# EAGLE schematic ai_gpiolabel_rpiplus (EAGLE 7.1.0)
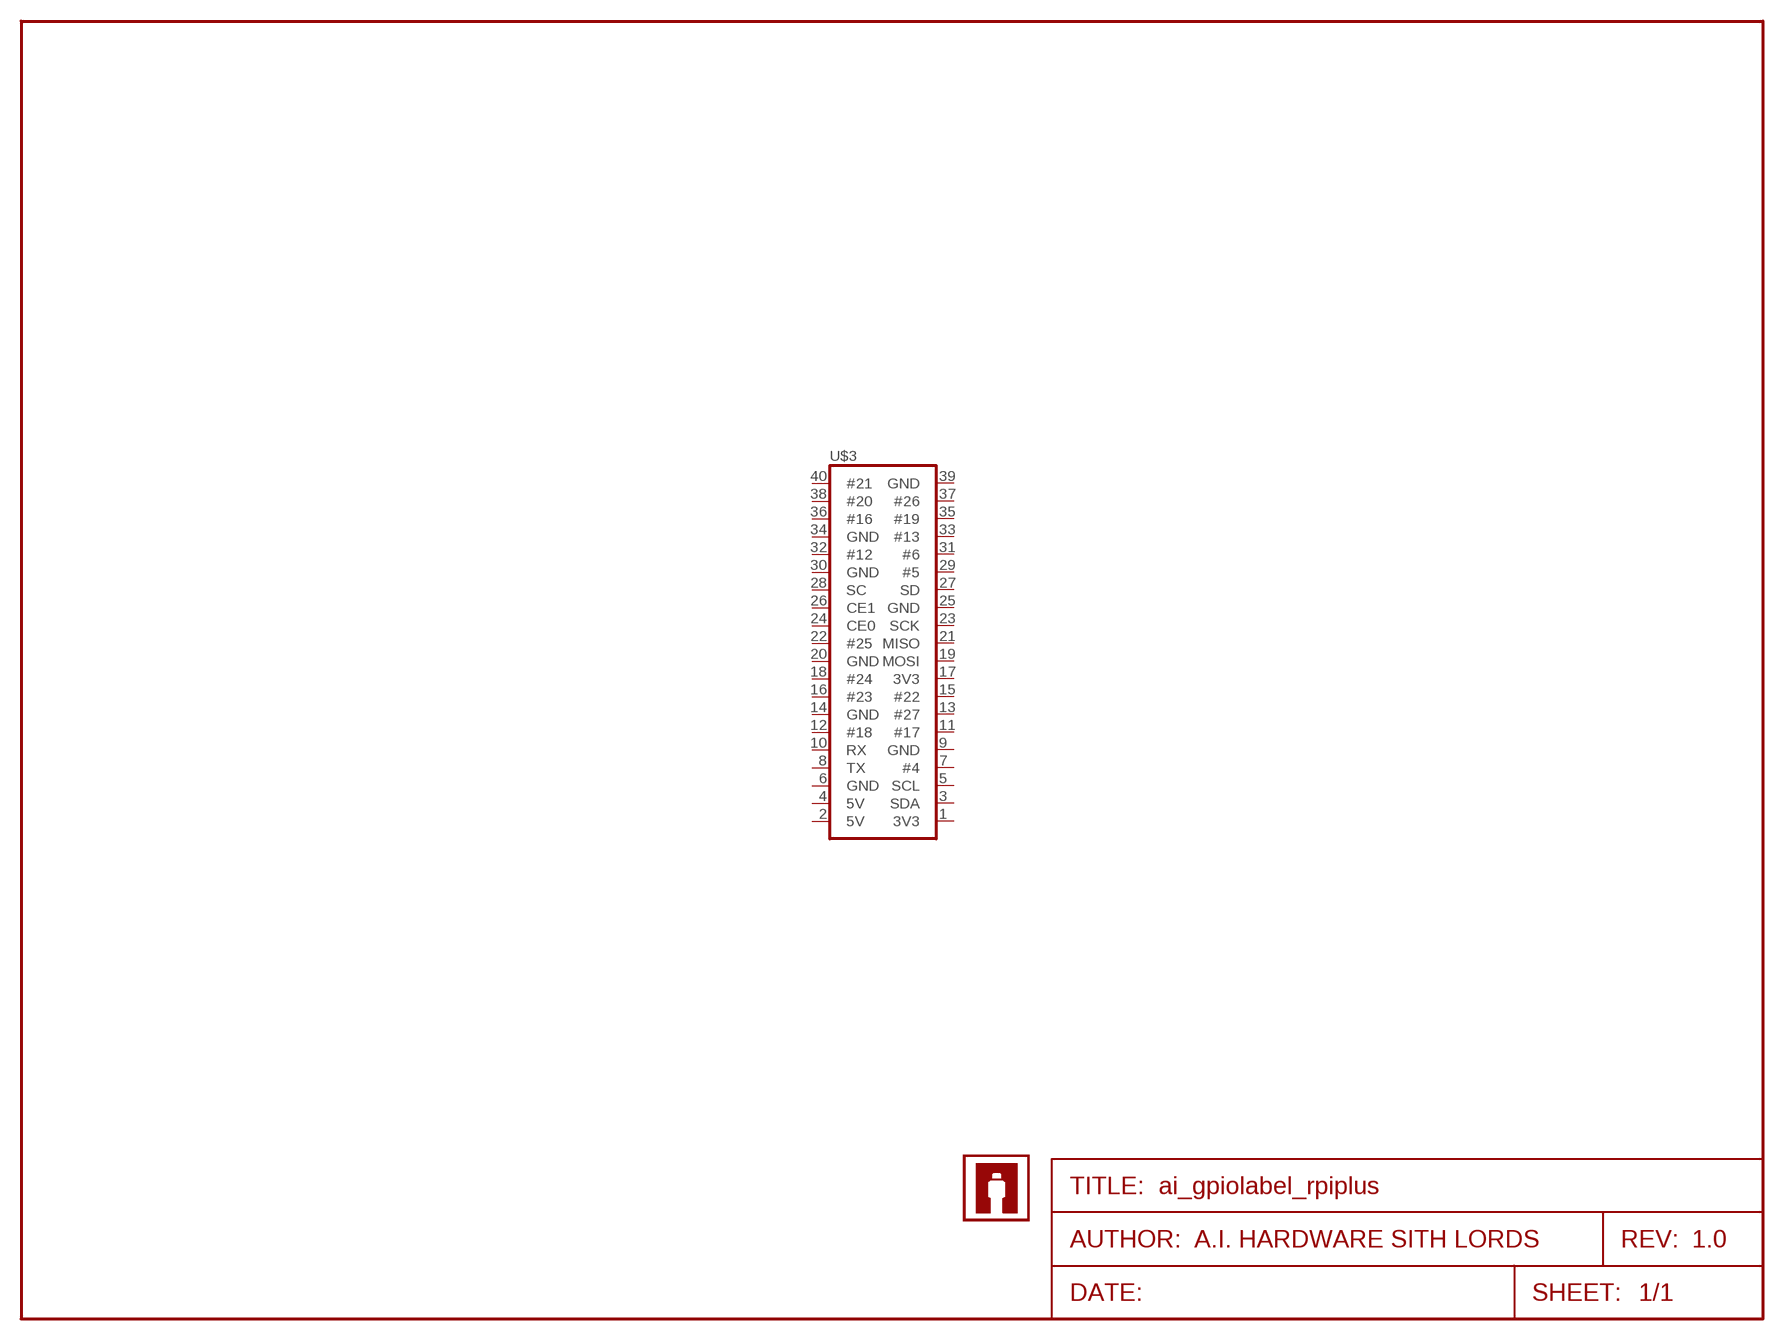
[diagram p0: schematic, sheet 1]
FRAME1 (FRAME-LETTER): AUTHOR: A.I. HARDWARE SITH LORDS; REV: 1.0

## Parts
U$2  AI-LOGOXS  [AI-LOGO-XS]
U$3  2X20-RPI-NOFIRST  [2X20-RPI-NOFIRST]
U$4  AI-LOGOXS  [AI-LOGO-XS]
Unconnected: U$3.1(3V3) U$3.2(5V) U$3.3(SDA) U$3.4(5V) U$3.5(SCL) U$3.6(GND) U$3.7(#4) U$3.8(TX) U$3.9(GND) U$3.10(RX) U$3.11(#17) U$3.12(#18) U$3.13(#27) U$3.14(GND) U$3.15(#22) U$3.16(#23) U$3.17(3V3) U$3.18(#24) U$3.19(MOSI) U$3.20(GND) U$3.21(MISO) U$3.22(#25) U$3.23(SCK) U$3.24(CE0) U$3.25(GND) U$3.26(CE1) U$3.27(SD) U$3.28(SC) U$3.29(#5) U$3.30(GND) U$3.31(#6) U$3.32(#12) U$3.33(#13) U$3.34(GND) U$3.35(#19) U$3.36(#16) U$3.37(#26) U$3.38(#20) U$3.39(GND) U$3.40(#21)

## Library data of the parts
U$2 U$4 = Ai_Miscellany:AI-LOGO
U$3 = Ai_Connectors:2X20-RPI